# EasyEDA schematic converter_schematic.json
TITLE: Messy Schematic; REV: 1.0; Date: 2024-03-07; Sheet: 1/1; Drawn By: bajajshaunak; Company: Usb Creator
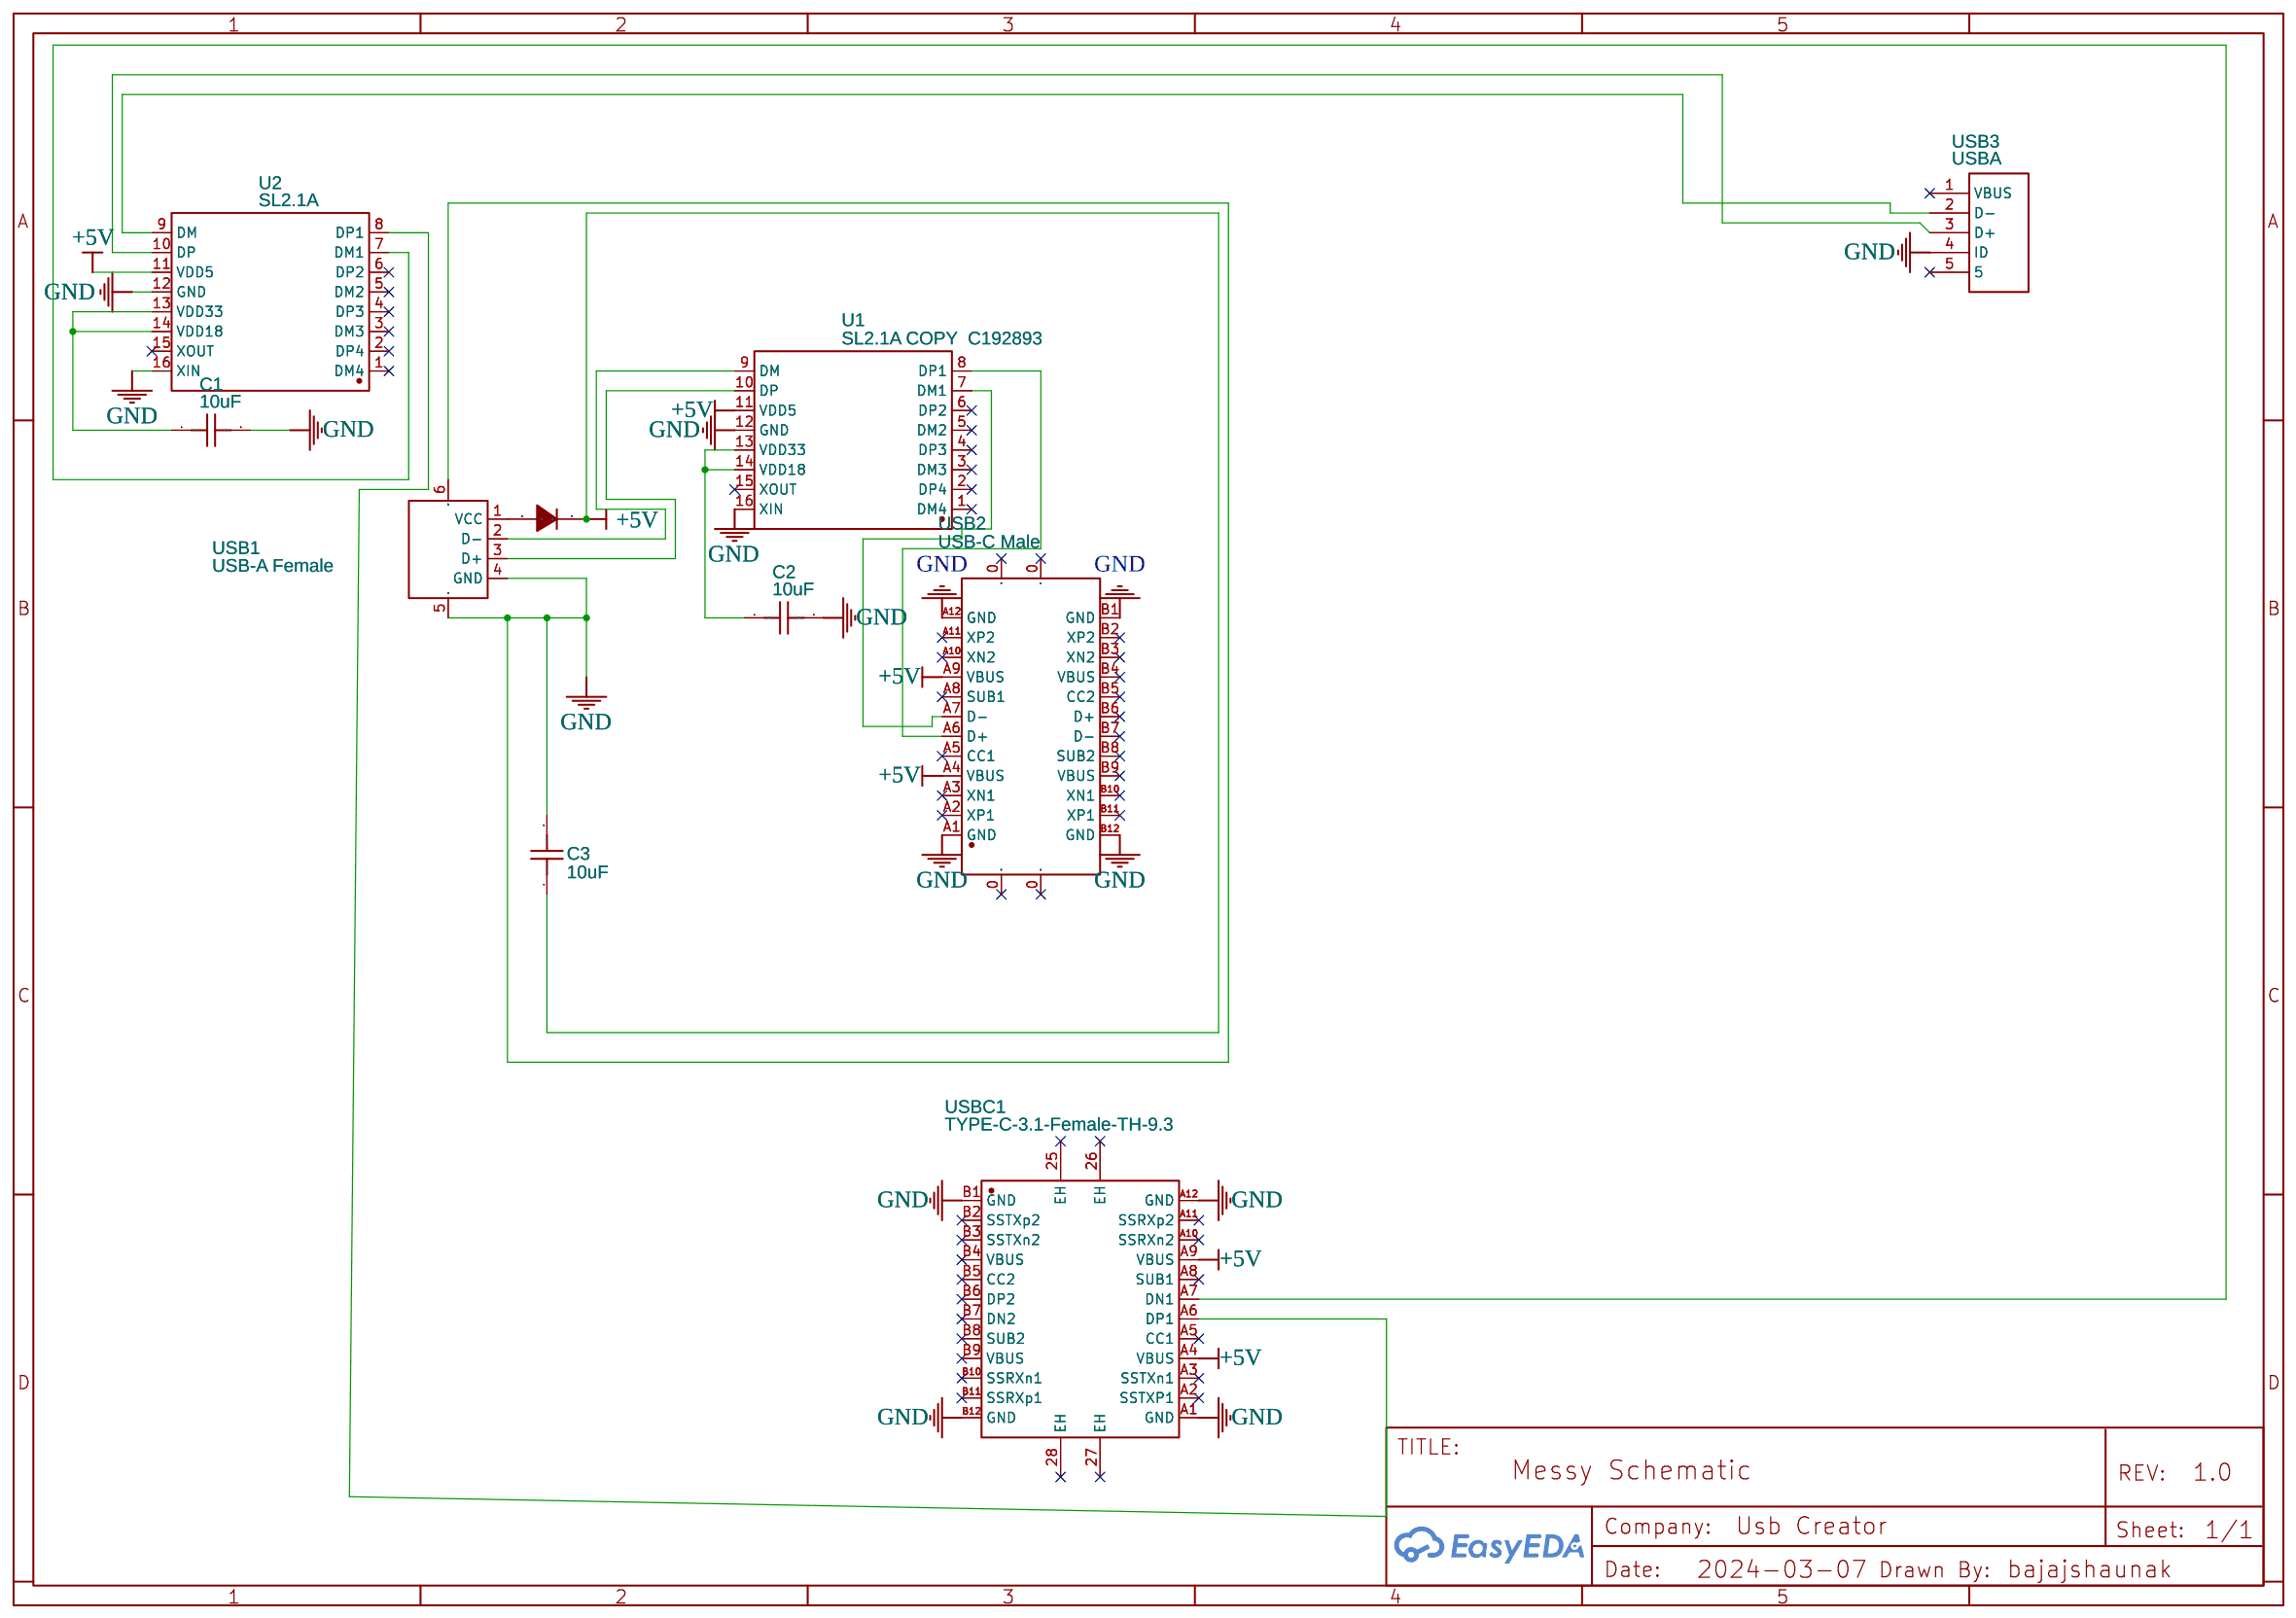
[diagram p0: schematic sheet]

## Parts
C1  10uF  [C0603]
C2  10uF  [C0603]
C3  10uF  [C0603]
D2  NSR0320MW2T1G  [SOD-323_L1.8-W1.3-LS2.5-RD]
U1  SL2.1A COPY  C192893  [SOP-16_L10.0-W3.9-P1.27-LS6.0-BL]
U2  SL2.1A  [SOP-16_L10.0-W3.9-P1.27-LS6.0-BL]
USB1  USB-A Female  [USB-A-TH_USB-AF-DIP-154-HW-S]
USB2  USB-C Male  [USB-C-SMD_28P-P0.50-L11.0-W8.6]
USB3  USBA  [USB-A-TH_U-USBAR04P-M002]
USBC1  TYPE-C-3.1-Female-TH-9.3  [USB-C-SMD_TYPE-C-3.1-FEMALE-TH-9.3]

## Library data of the parts
C1-C3 = CL10A106KP8NNNC: Supplier: LCSC; Manufacturer: SAMSUNG(三星); Supplier Part: C19702; JLCPCB Part Class: Basic Part
D2 = NSR0320MW2T1G: Supplier: LCSC; Manufacturer: onsemi(安森美); Supplier Part: C48192; JLCPCB Part Class: Extended Part
U1 = SL2.1A COPY  C192893: Contributor: LCSC; Supplier: LCSC; Supplier Part: C192893; Manufacturer: CoreChips(和芯润德); Manufacturer Part: SL2.1A; JLCPCB Part Class: Extended Part
U2 = SL2.1A: Contributor: LCSC; Supplier: LCSC; Supplier Part: C192893; Manufacturer: CoreChips(和芯润德); JLCPCB Part Class: Extended Part
USB1 = USB-AF-DIP-154-HW-S: Contributor: LCSC; Supplier: LCSC; Supplier Part: C2904892; Manufacturer: 皇捷; JLCPCB Part Class: Extended Part
USB2 = USB-307HI: Contributor: LCSC; Supplier: LCSC; Supplier Part: C309357; Manufacturer: HOOYA(皓宇电子); JLCPCB Part Class: Extended Part
USB3 = U-USBAR04P-M002: Contributor: LCSC; Supplier: LCSC; Supplier Part: C386753; Manufacturer: Ckmtw(灿科盟); Manufacturer Part: U-USBAR04P-M001; JLCPCB Part Class: Extended Part
USBC1 = TYPE-C-3.1-Female-TH-9.3: Contributor: LCSC; Supplier: LCSC; Supplier Part: C168703; Manufacturer: 精拓金; Manufacturer Part: 918-418K2022Y40004; JLCPCB Part Class: Extended Part

## Nets
+5V: C3.1 D2.1(C) U1.11(VDD5) U2.11(VDD5) USB2.A4(VBUS) USB2.A9(VBUS) USBC1.A4(VBUS) USBC1.A9(VBUS)
GND: C1.2 C2.2 C3.2 U1.12(GND) U1.16(XIN) U2.12(GND) U2.16(XIN) USB1.4(GND) USB1.5(SH1) USB1.6(SH2) USB2.A1(GND) USB2.A12(GND) USB2.B1(GND) USB2.B12(GND) USB3.4(ID) USBC1.A1(GND) USBC1.A12(GND) USBC1.B1(GND) USBC1.B12(GND)
Net-(C1-1): C1.1 U2.13(VDD33) U2.14(VDD18)
Net-(C2-1): C2.1 U1.13(VDD33) U1.14(VDD18)
Net-(D2-2): D2.2(A) USB1.1(VCC)
Net-(U1-7): U1.7(DM1) USB2.A7(D-)
Net-(U1-8): U1.8(DP1) USB2.A6(D+)
Net-(U1-9): U1.9(DM) USB1.2(D-)
Net-(U1-10): U1.10(DP) USB1.3(D+)
Net-(U2-7): U2.7(DM1) USBC1.A7(DN1)
Net-(U2-8): U2.8(DP1) USBC1.A6(DP1)
Net-(U2-9): U2.9(DM) USB3.2(D-)
Net-(U2-10): U2.10(DP) USB3.3(D+)

Not connected (* = marked no-connect by the designer): U1 1(DM4)* 2(DP4)* 3(DM3)* 4(DP3)* 5(DM2)* 6(DP2)* 15(XOUT)*; U2 1(DM4)* 2(DP4)* 3(DM3)* 4(DP3)* 5(DM2)* 6(DP2)* 15(XOUT)*; USB2 0* A2(XP1)* A3(XN1)* A5(CC1)* A8(SUB1)* A10(XN2)* A11(XP2)* B2(XP2)* B3(XN2)* B4(VBUS)* B5(CC2)* B6(D+)* B7(D-)* B8(SUB2)* B9(VBUS)* B10(XN1)* B11(XP1)*; USB3 1(VBUS)* 5*; USBC1 25(EH)* 26(EH)* 27(EH)* 28(EH)* A2(SSTXP1)* A3(SSTXn1)* A5(CC1)* A8(SUB1)* A10(SSRXn2)* A11(SSRXp2)* B2(SSTXp2)* B3(SSTXn2)* B4(VBUS)* B5(CC2)* B6(DP2)* B7(DN2)* B8(SUB2)* B9(VBUS)* B10(SSRXn1)* B11(SSRXp1)*
